# EAGLE design LB_BIT_i13_LIGHTSENSOR-v02(rev1) 01 (EAGLE 6.1)
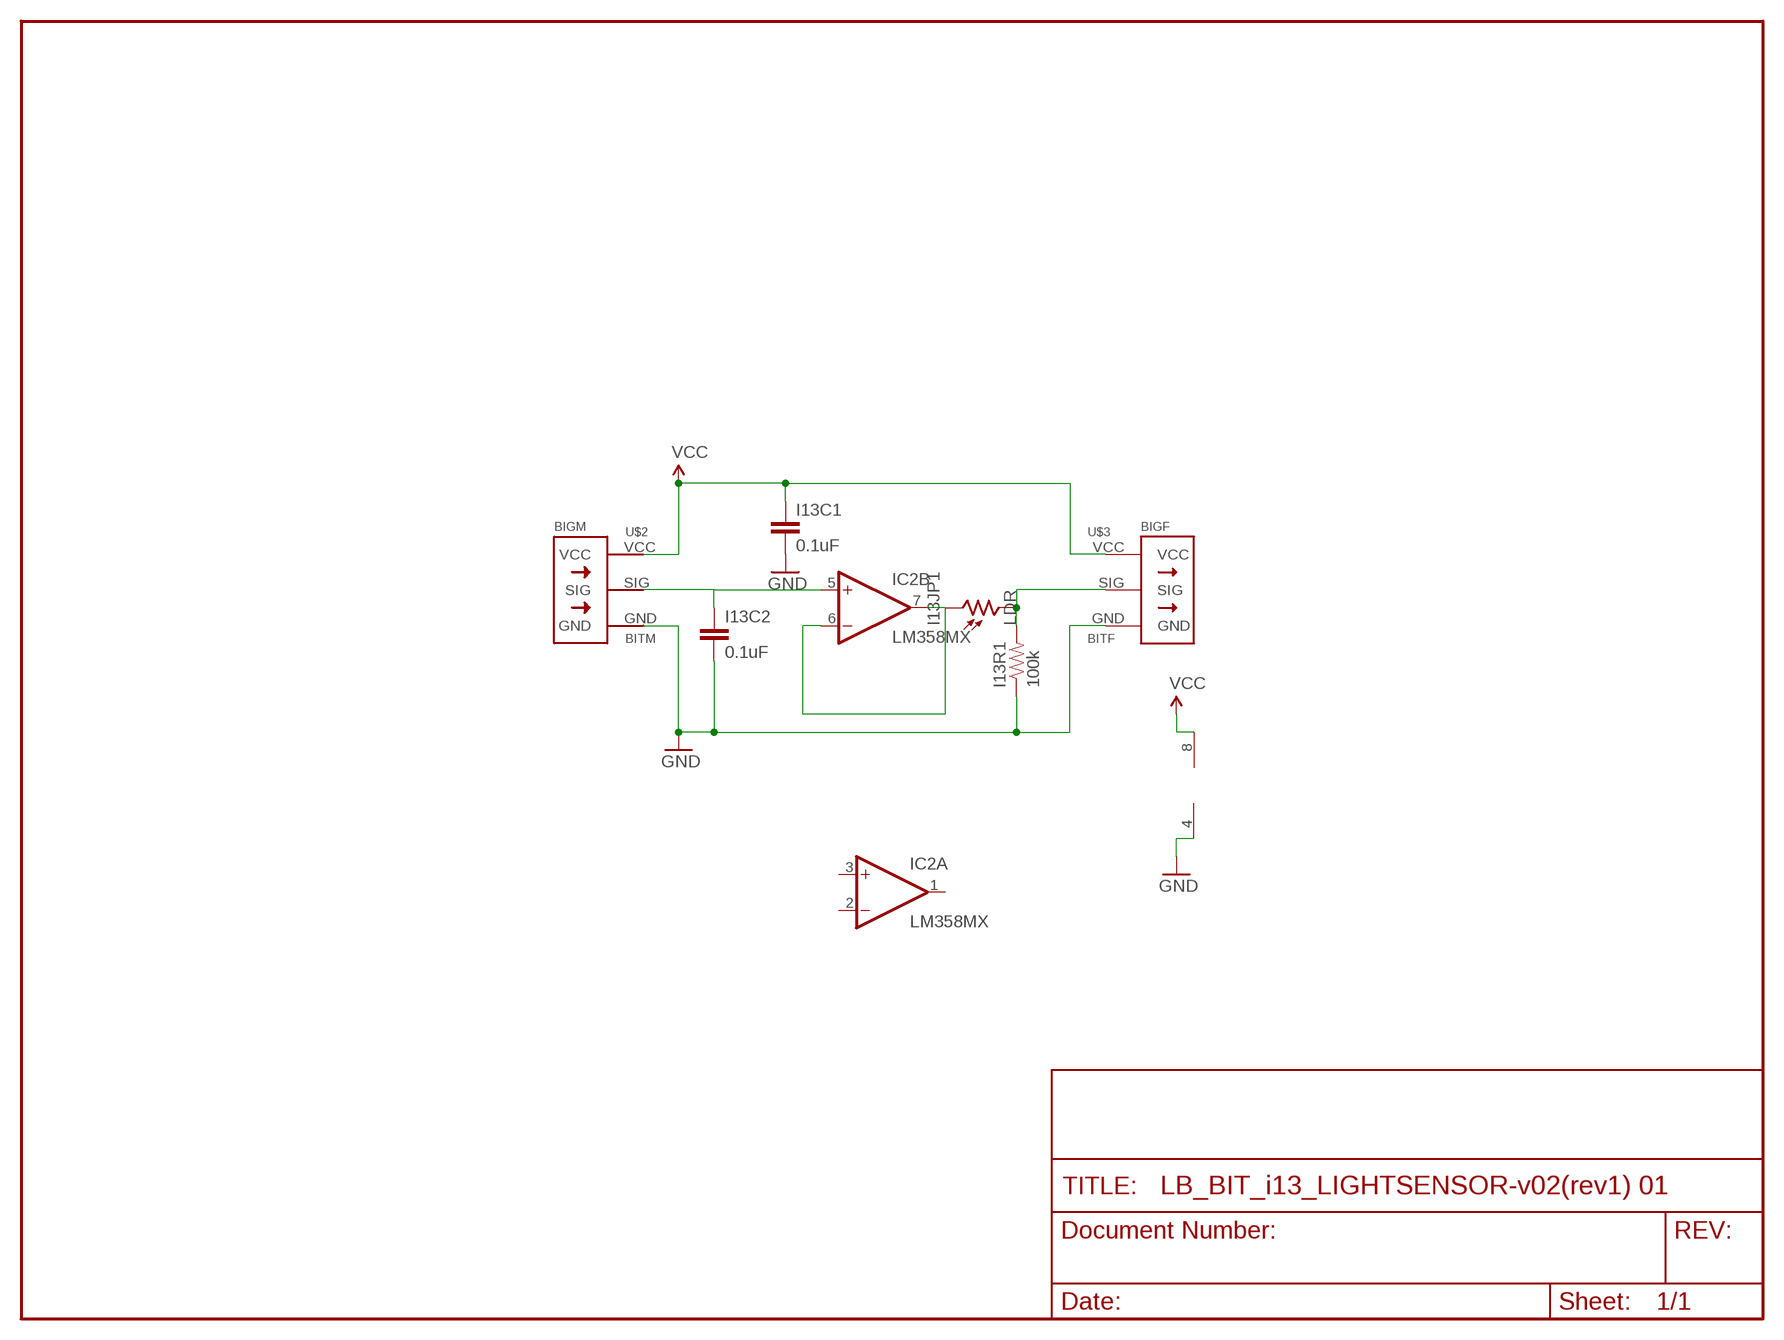
[diagram p0: schematic, sheet 1]

## Parts
I13C1  0.1uF  CAP1206  [1206]
I13C2  0.1uF  CAP1206  [1206]
I13JP1  LDR  A1050_09  [T0-46-A10XX]
I13R1  100k  RESISTOR0805-RES  [0805]
IC2  LM358MX  [SO08]
U$2  BITM  [BITM]
U$3  BITF  [BITM]

## Nets
GND: I13C1.2 I13C2.2 I13R1.1 IC2.4(P:V-) U$2.GND U$3.GND
N$6: I13JP1.1 IC2.6(B:-IN) IC2.7(B:OUT)
PS: I13JP1.2 I13R1.2 U$3.SIG
SIG: I13C2.1 IC2.5(B:+IN) U$2.SIG
VCC: I13C1.1 IC2.8(P:V+) U$2.VCC U$3.VCC
Unconnected: IC2.1(A:OUT) IC2.2(A:-IN) IC2.3(A:+IN)

## Library data of the parts
I13C1 I13C2 = SparkFun:CAP: Capacitor Standard 0603 ceramic capacitor, and 0.1" leaded capacitor.
I13JP1 = photo-elements:A10: Sensor Robust Light Sensing Applications Outdoor Light Sensing Application Source: http://optoelectronics.perkinelmer.com/content/Datasheets/DTS_PhotocellsA1050.pdf
I13R1 = SparkFun:RESISTOR: Resistor Basic schematic elements and footprints for 0603, 1206, and PTH resistors.
IC2 = linear:LM358: OP AMP also LM158; LM258; LM2904 Source: http://cache.national.com/ds/LM/LM158.pdf
U$2 = radames:BITM
U$3 = radames:BITF

## Board
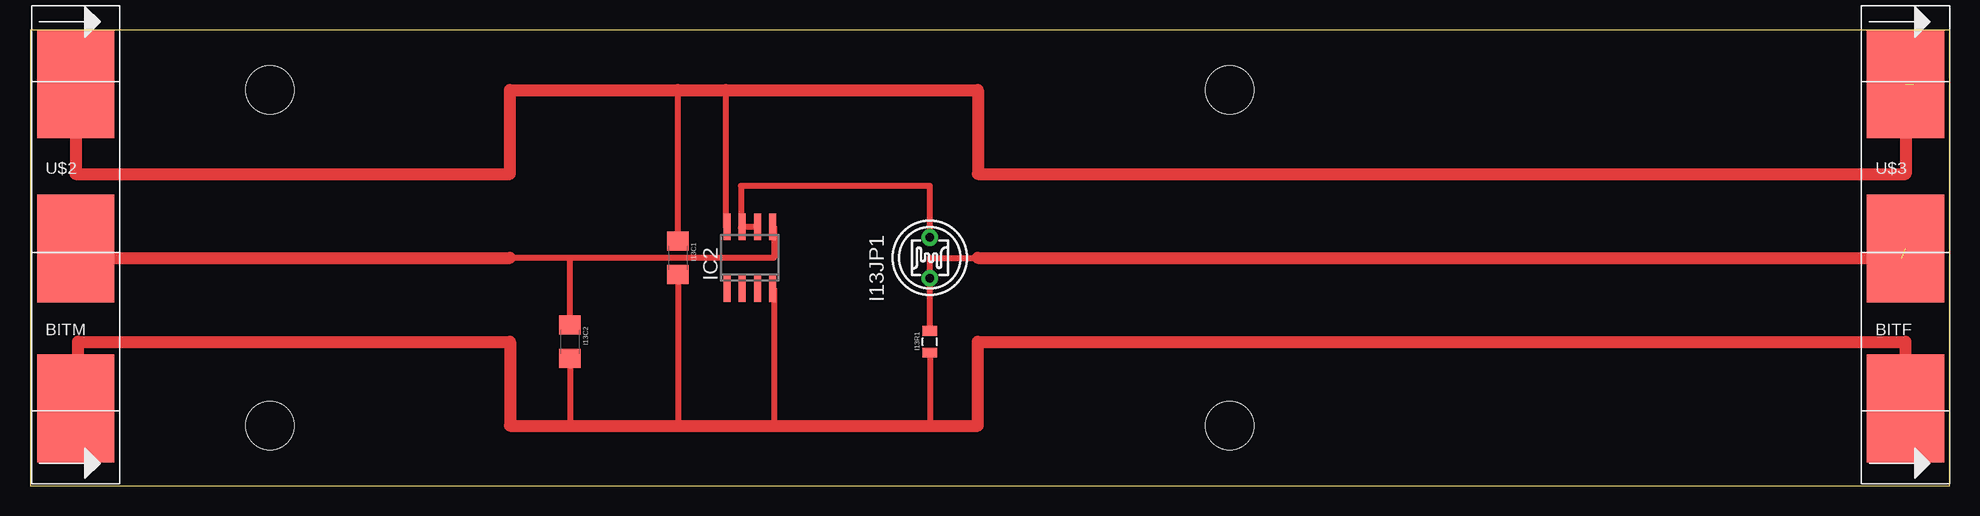
[diagram p1: board, top side]

Size 160 x 38 mm. Coordinates in mm from the lower left corner, seen from the top.
Outline: 0,0 160,0 160,38 0,38 0,0
Copper layers (1*16): Top 0.035mm / dielectric 1.5mm / Bottom 0.035mm
Design rules: minimum track width 10mil, minimum drill 24mil, track to track 8mil, track to pad 8mil, pad to pad 8mil, via to via 8mil, smd to smd 8mil, copper to edge 40mil, drill to drill 8mil, minimum pad ring 10mil, minimum via ring 8mil, stop-mask expansion 4mil, vias tented up to drill 0mil, thermal gap 10mil
Holes 4 mm at 20,33 20,5 100,5 100,33

### Footprints (pad centres in the part's own frame; a part is rotated, then mirrored left to right if it is on the bottom)
1206 = smd 1.6 x 1.8: 1 -1.4,0; 2 1.4,0
T0-46-A10XX = drill 0.7 pad 1.4: 1 -1.7,0; 2 1.7,0
0805 = smd 0.8 x 1.2: 1 -0.9,0; 2 0.9,0
SO08 = smd 0.6 x 2.2: 1 -1.905,-2.6; 2 -0.635,-2.6; 3 0.635,-2.6; 4 1.905,-2.6; 5 1.905,2.6; 6 0.635,2.6; 7 -0.635,2.6; 8 -1.905,2.6
BITM = smd 6.452 x 8.992: GND 3.81,-13.145; SIG 3.81,0.191; VCC 3.81,13.906

### Placement (x,y rotation side)
I13C1  54,19 270 top
I13C2  45,12 270 top
I13JP1  75,19 270 top
I13R1  75,12 90 top
IC2  60,19 0 top
U$2  0,19.57 0 top
U$3  152.53,19.57 0 top

### Tracks (layer width: path | path; a pad name or v marks a point on that pad's centre or on a via)
GND
  Top 0.5: I13C2.2 45,5 | I13C1.2 54,5 | I13R1.1 75,5 | IC2.4 62,16.4 62,5
  Top 1: U$2.GND arc90 4,6.62 4,12 40,12 40,5 45,5 54,5 62,5 75,5 79,5 79,12 156.34,12 U$3.GND
N$6
  Top 0.5: I13JP1.1 75,25 59.25,25 59.25,21.5 59.37,21.5 IC2.7 IC2.6
PS  (1 unrouted)
  Top 0.5: I13R1.2 I13JP1.2 75,19 79,19
  Top 1: 79,19 156,19
SIG
  Top 0.5: I13C2.1 45,19 | 45,19 40,19 | IC2.5 62,21.6 62,19 45,19
  Top 1: U$2.SIG 3.81,19 40,19
VCC  (1 unrouted)
  Top 0.5: I13C1.1 54,33 | IC2.8 58,21.6 58,33
  Top 1: U$2.VCC 3.81,26 40,26 40,33 54,33 58,33 79,33 79,26 156.34,26 U$3.VCC
  Top 1.016: 157,33.48 157,34